# Altium schematic sheet Sheet_1_2023-02-11.schdoc
size 223 x 186 mm
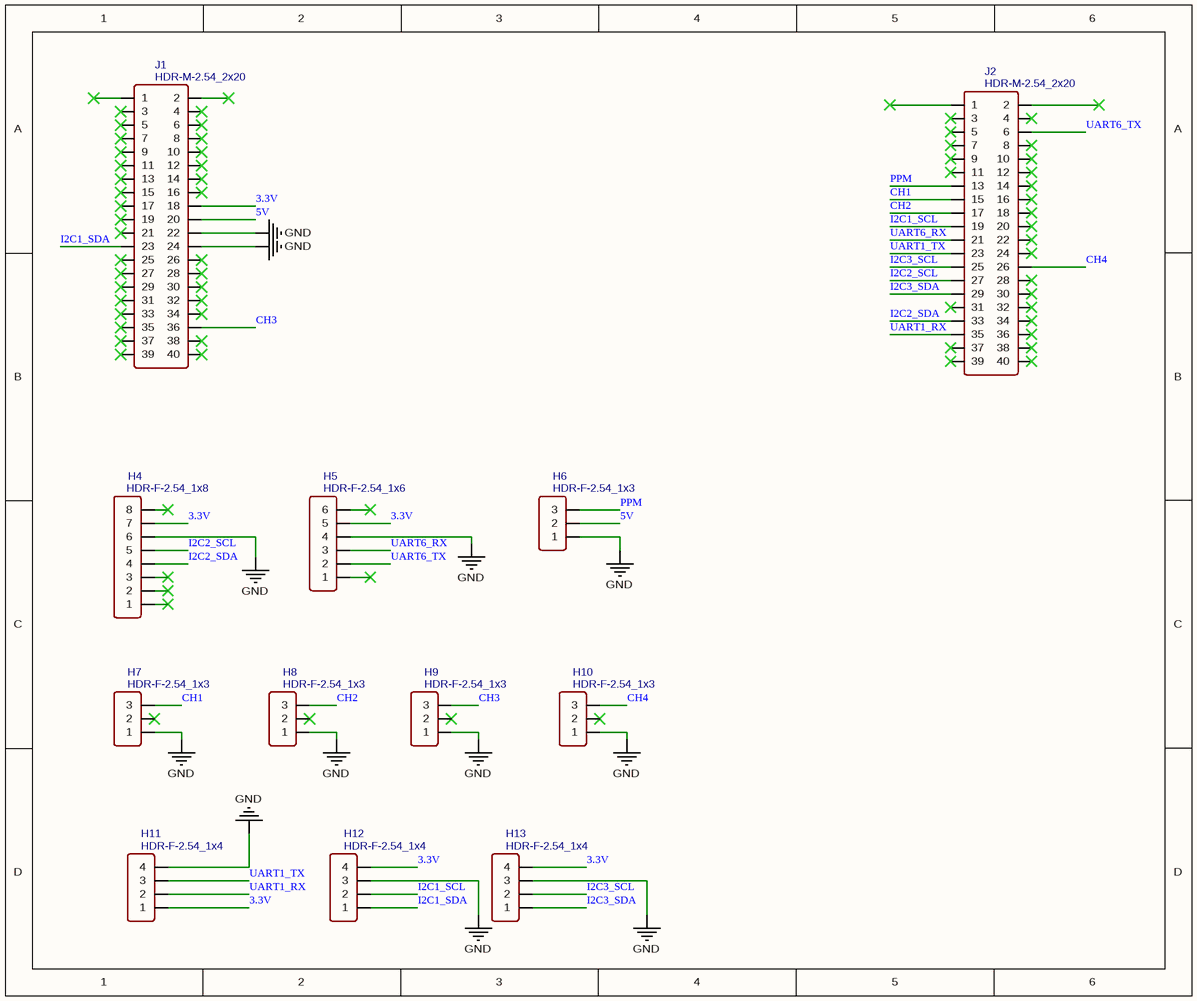
[diagram p0: Sheet_1_2023-02-11.schdoc]

## Parts
H4  HDR-F-2.54_1x8  [HDR-F-2.54_1X8]
H5  HDR-F-2.54_1x6  [HDR-F-2.54_1X6]
H6  HDR-F-2.54_1x3  [HDR-F-2.54_1X3]
H7  HDR-F-2.54_1x3  [HDR-F-2.54_1X3]
H8  HDR-F-2.54_1x3  [HDR-F-2.54_1X3]
H9  HDR-F-2.54_1x3  [HDR-F-2.54_1X3]
H10  HDR-F-2.54_1x3  [HDR-F-2.54_1X3]
H11  HDR-F-2.54_1x4  [HDR-F-2.54_1X4]
H12  HDR-F-2.54_1x4  [HDR-F-2.54_1X4]
H13  HDR-F-2.54_1x4  [HDR-F-2.54_1X4]
J1  HDR-M-2.54_2x20  [HDR-M-2.54_2X20]
J2  HDR-M-2.54_2x20  [HDR-M-2.54_2X20]

## Nets
GND: H4.6 H5.4 H6.1 H7.1 H8.1 H9.1 H10.1 H11.4 H12.3 H13.3 J1.22 J1.24
3.3V: H4.7 H5.5 H11.1 H12.4 H13.4 J1.18
5V: H6.2 J1.20
CH1: H7.3 J2.15
CH2: H8.3 J2.17
CH3: H9.3 J1.36
CH4: H10.3 J2.26
I2C1_SCL: H12.2 J2.19
I2C1_SDA: H12.1 J1.23
I2C2_SCL: H4.5 J2.27
I2C2_SDA: H4.4 J2.33
I2C3_SCL: H13.2 J2.25
I2C3_SDA: H13.1 J2.29
PPM: H6.3 J2.13
UART1_RX: H11.2 J2.35
UART1_TX: H11.3 J2.23
UART6_RX: H5.3 J2.21
UART6_TX: H5.2 J2.6

Not connected (* = marked no-connect by the designer): H4 1* 2* 3* 8*; H5 1* 6*; H7 2*; H8 2*; H9 2*; H10 2*; J1 1* 2* 3* 4* 5* 6* 7* 8* 9* 10* 11* 12* 13* 14* 15* 16* 17* 19* 21* 25* 26* 27* 28* 29* 30* 31* 32* 33* 34* 35* 37* 38* 39* 40*; J2 1* 2* 3* 4* 5* 7* 8* 9* 10* 11* 12* 14* 16* 18* 20* 22* 24* 28* 30* 31* 32* 34* 36* 37* 38* 39* 40*

## Library data of the parts
H4 = HDR-F-2.54_1x8: Contributor: LCEDA_Lib; BOM_Supplier Part: C225505; BOM_Supplier: LCSC; spicePre: H; spiceSymbolName: HDR-F-2.54_1x8
H5 = HDR-F-2.54_1x6: Contributor: LCEDA_Lib; BOM_Supplier Part: C40877; BOM_Supplier: LCSC; spicePre: H; spiceSymbolName: HDR-F-2.54_1x6
H6-H10 = HDR-F-2.54_1x3: Contributor: LCEDA_Lib; BOM_Supplier Part: C146690; BOM_Supplier: LCSC; spicePre: H; spiceSymbolName: HDR-F-2.54_1x3
H11-H13 = HDR-F-2.54_1x4: Contributor: LCEDA_Lib; BOM_Supplier Part: C225501; BOM_Supplier: LCSC; spicePre: H; spiceSymbolName: HDR-F-2.54_1x4
J1 J2 = HDR-M-2.54_2x20: Contributor: LCEDA_Lib; BOM_Supplier Part: C50980; BOM_Supplier: LCSC; spicePre: J; spiceSymbolName: HDR-M-2.54_2x20